# EAGLE design canboard (EAGLE 5.09)
REV: 0.1a

## Sheet 1 of 3
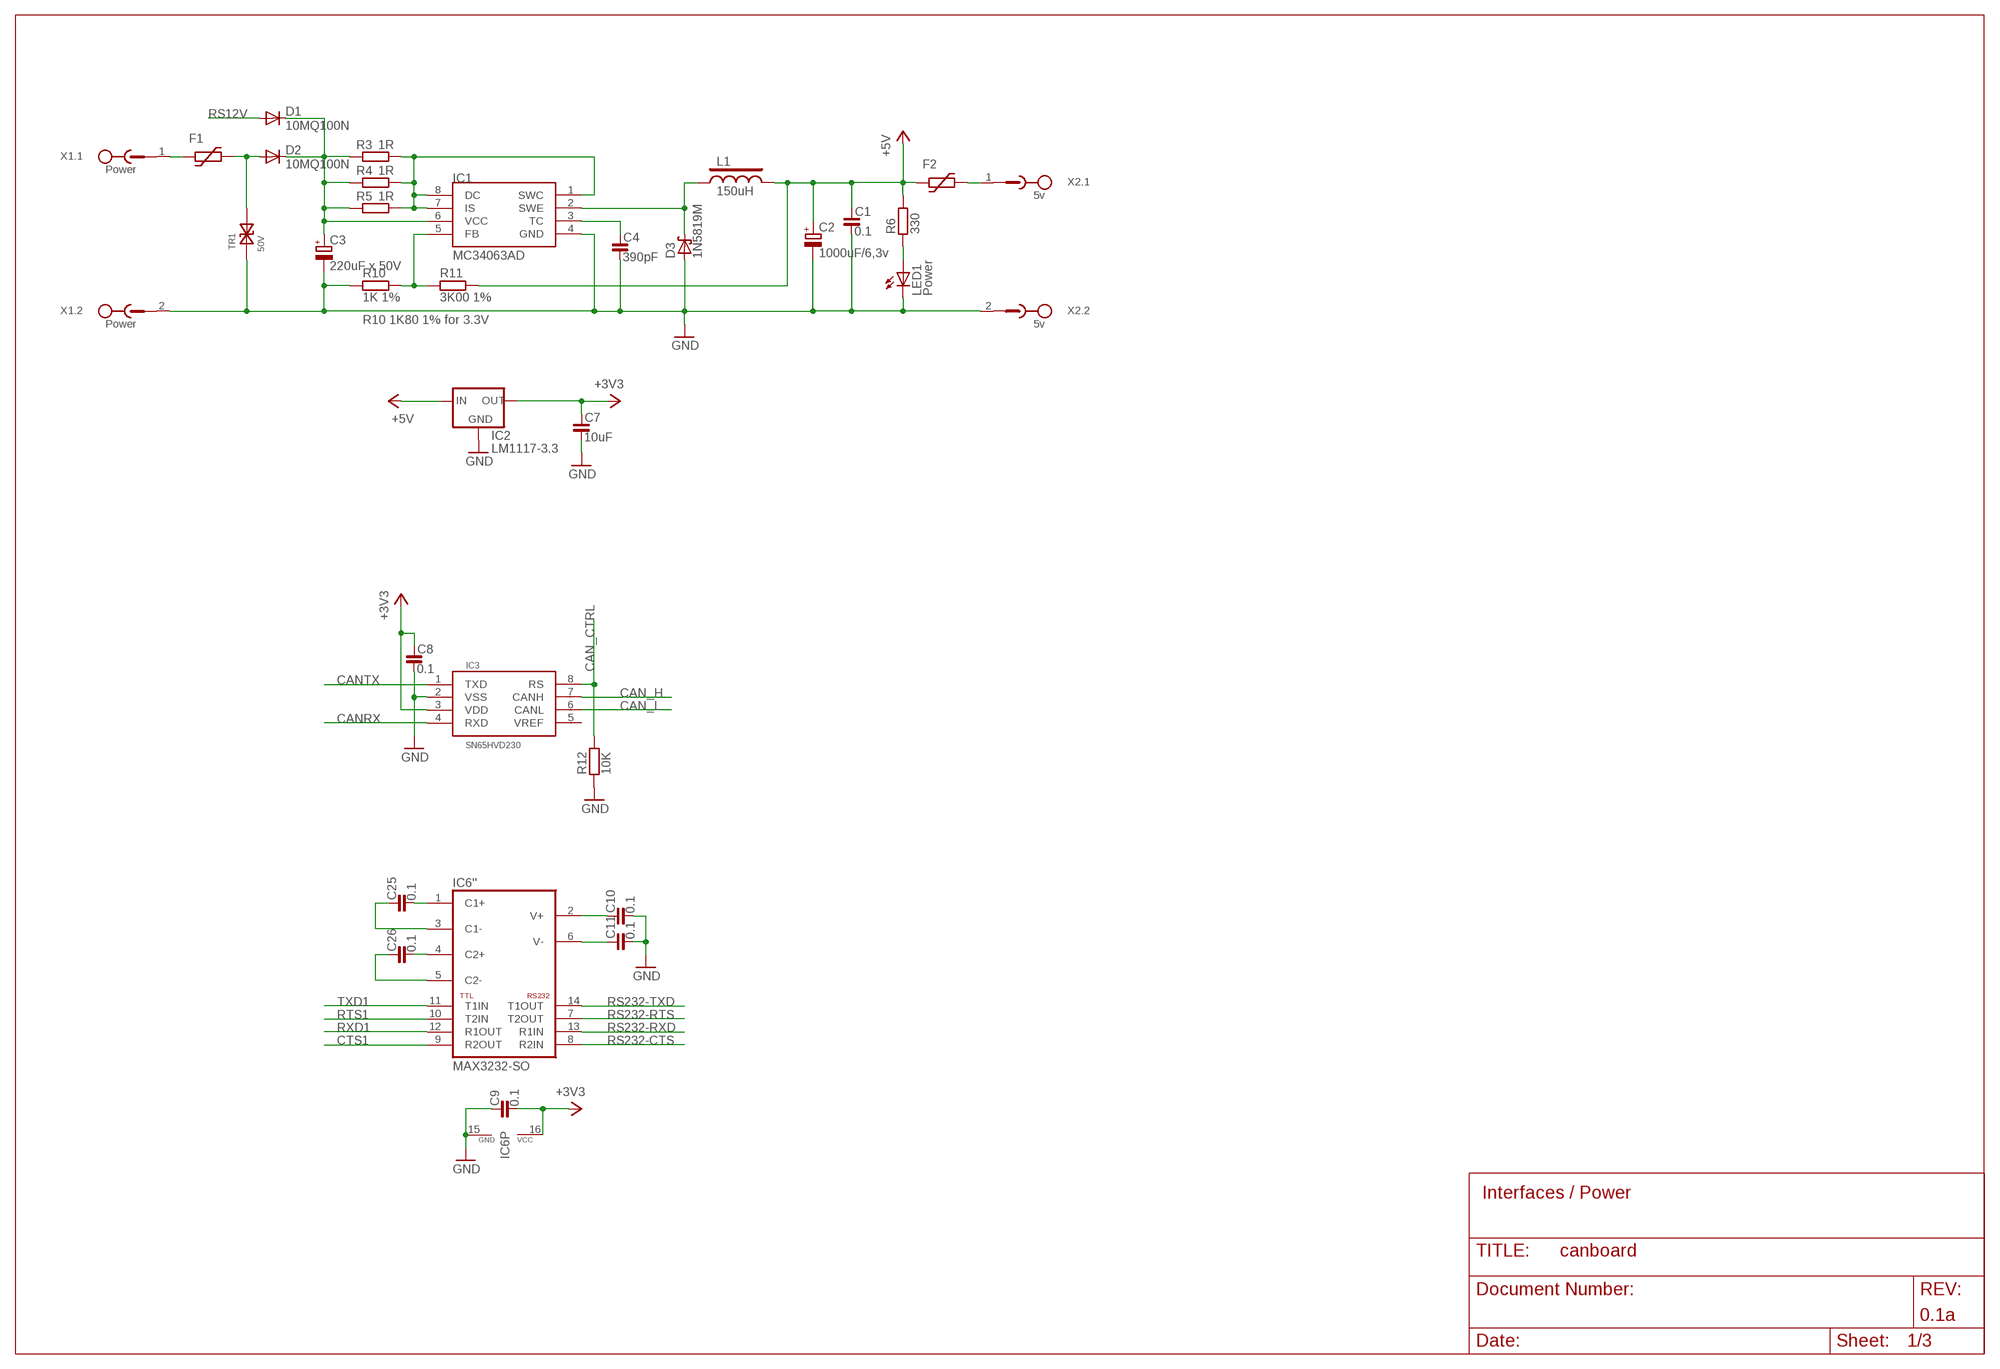
[diagram p0: schematic, sheet 1]

### Parts
C1  0.1  C_0805  [C0805]
C2  1000uF/6,3v  CPOL-E3.5-8  [E3,5-8]
C3  220uF x 50V  CPOL-E3.5-8  [E3,5-8]
C4  390pF  C_0603  [C0603]
C7  10uF  C_0603  [C0603]
C8  0.1  C_0603  [C0603]
C9  0.1  C_0603  [C0603]
C10  0.1  C_0603  [C0603]
C11  0.1  C_0603  [C0603]
C25  0.1  C_0603  [C0603]
C26  0.1  C_0603  [C0603]
D1  10MQ100N  DIODE-SMB  [SMB]
D2  10MQ100N  DIODE-SMB  [SMB]
D3  1N5819M  SCHOTTKY-MELF  [MELF-MLL41]
F1  1812L  [1812L]
F2  1812L  [1812L]
IC1  MC34063AD  [SOIC8]
IC2  LM1117-3.3  LM1117  [SOT223]
IC3  SN65HVD230  [SO8]
IC6  MAX3232-SO  MAX232-SO  [SO16]
L1  150uH  L-RCH895  [RCH895]
LED1  Power  LED3MM  [LED3MM]
R3  1R  R_0805  [R0805]
R4  1R  R_0805  [R0805]
R5  1R  R_0805  [R0805]
R6  330  R_0603  [R0603]
R10  1K 1%  R_0603  [R0603]
R11  3K00 1%  R_0603  [R0603]
R12  10K  R_0603  [R0603]
TR1  50V  TRANSIL-SMB  [SMB]
X1  Power  MC2-G  [MC2-G]
X2  5v  MC2-G  [MC2-G]

### Nets
+3V3: C7.1 C8.1 C9.2 IC2.2(OUT) IC3.3(VDD) IC6.16(P:VCC) ; also sheet 2,3
+5V: C1.1 C2.+ F2.P$1 IC2.3(IN) L1.2 R6.2 R11.2 ; also sheet 3
CAN_CTRL: IC3.8(RS) R12.2
CAN_H: IC3.7(CANH)
CAN_L: IC3.6(CANL)
CANRX: IC3.4(RXD) ; also sheet 2
CANTX: IC3.1(TXD) ; also sheet 2
CTS1: IC6.9('':R2OUT)
GND: C1.2 C2.- C3.- C4.2 C7.2 C8.2 C9.1 C10.2 C11.2 D3.A IC1.4(GND) IC2.1(GND) IC3.2(VSS) IC6.15(P:GND) LED1.K(C) R10.1 R12.1 TR1.A X1.2 X2.2 ; also sheet 2,3
N$1: C4.1 IC1.3(TC)
N$2: D3.C IC1.2(SWE) L1.1
N$3: LED1.A R6.1
N$4: D2.A F1.P$2 TR1.C
N$5: IC1.5(FB) R10.2 R11.1
N$6: IC1.1(SWC) IC1.7(IS) IC1.8(DC) R3.2 R4.2 R5.2
N$7: F1.P$1 X1.1
N$19: F2.P$2 X2.1
N$80: C10.1 IC6.2('':V+)
N$81: C11.1 IC6.6('':V-)
N$82: C26.1 IC6.5('':C2-)
N$83: C26.2 IC6.4('':C2+)
N$84: C25.1 IC6.3('':C1-)
N$85: C25.2 IC6.1('':C1+)
RS12V: D1.A
RS232-CTS: IC6.8('':R2IN)
RS232-RTS: IC6.7('':T2OUT)
RS232-RXD: IC6.13('':R1IN)
RS232-TXD: IC6.14('':T1OUT)
RTS1: IC6.10('':T2IN)
RXD1: IC6.12('':R1OUT) ; also sheet 2
TXD1: IC6.11('':T1IN) ; also sheet 2
VPOW: C3.+ D1.C D2.C IC1.6(VCC) R3.1 R4.1 R5.1
Unconnected: IC3.5(VREF)

### Notes on the sheet
- R10 1K80 1% for 3.3V
- Interfaces / Power

## Sheet 2 of 3
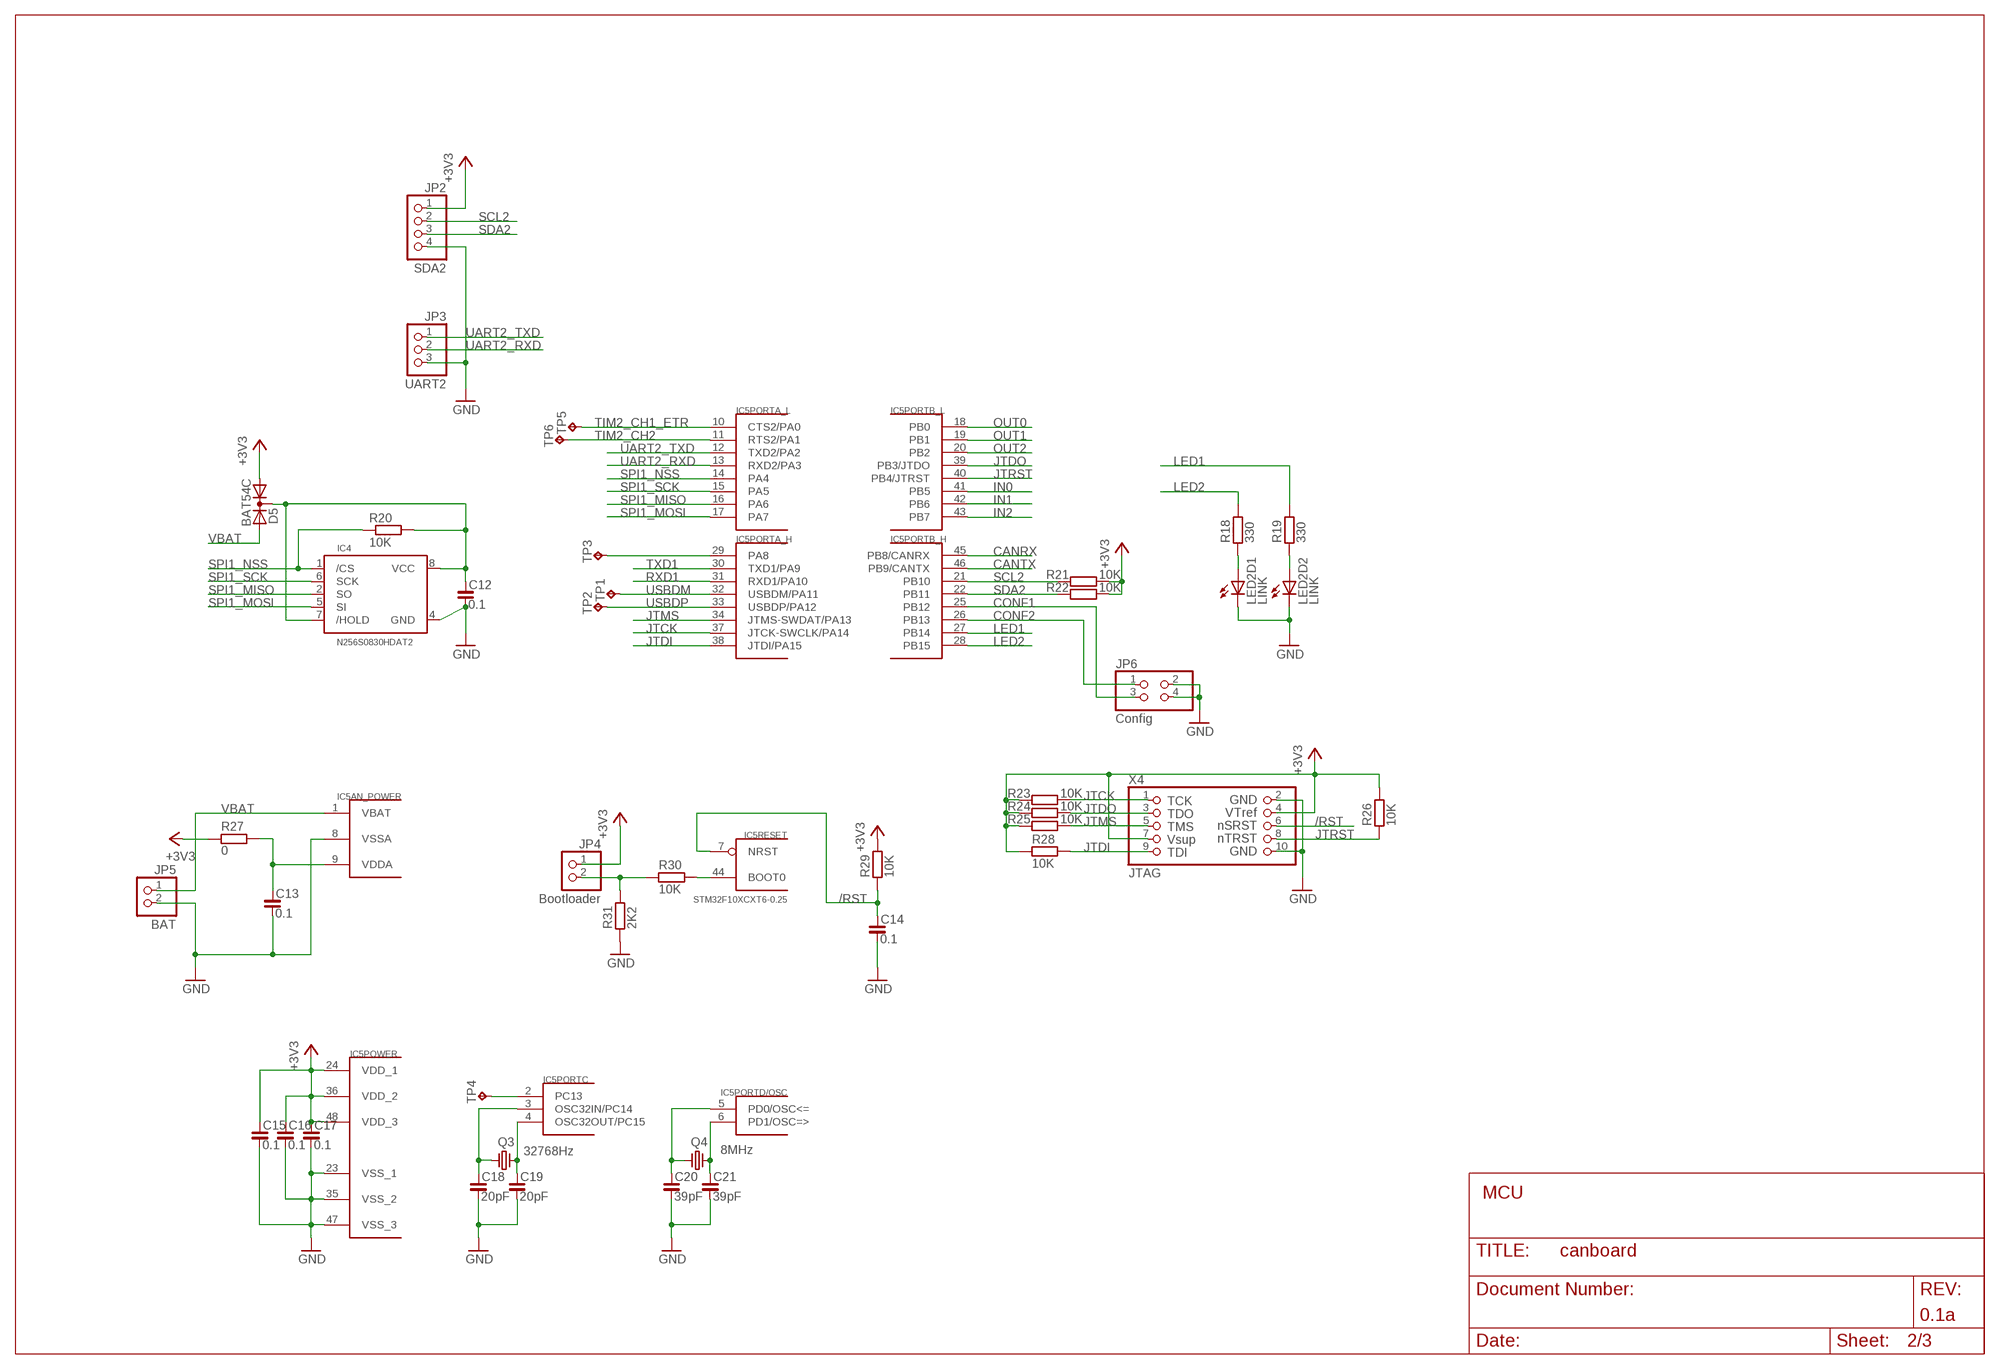
[diagram p1: schematic, sheet 2]

### Parts
C12  0.1  C_0603  [C0603]
C13  0.1  C_0603  [C0603]
C14  0.1  C_0603  [C0603]
C15  0.1  C_0603  [C0603]
C16  0.1  C_0603  [C0603]
C17  0.1  C_0603  [C0603]
C18  20pF  C_0603  [C0603]
C19  20pF  C_0603  [C0603]
C20  39pF  C_0603  [C0603]
C21  39pF  C_0603  [C0603]
D5  BAT54C  DIODE_AC-CA_  [SOT23C]
IC4  N256S0830HDAT2  [TSSOP8]
IC5  STM32F10XCXT6-0.25  [TQFP48-0.24]
JP2  SDA2  PINHD-1X4_2.00  [1X04M]
JP3  UART2  PINHD-1X3_2.00  [1X03M]
JP4  Bootloader  PINHD-1X2_2.54  [1X02]
JP5  BAT  PINHD-1X2_2.54  [1X02]
JP6  Config  PINHD-2X2_2.54  [2X02]
LED2  LINK  ANGLED2  [LED2ANGLE]
Q3  32768Hz  CRYSTAL-TC26H  [TC26H]
Q4  8MHz  CRYSTAL-HC49S  [HC49/S]
R18  330  R_0603  [R0603]
R19  330  R_0603  [R0603]
R20  10K  R-R0603  [R0603]
R21  10K  R_0603  [R0603]
R22  10K  R_0603  [R0603]
R23  10K  R_0603  [R0603]
R24  10K  R_0603  [R0603]
R25  10K  R_0603  [R0603]
R26  10K  R_0603  [R0603]
R27  0  R_0603  [R0603]
R28  10K  R_0603  [R0603]
R29  10K  R_0603  [R0603]
R30  10K  R_0603  [R0603]
R31  2K2  R_0603  [R0603]
TP1  TPB1,27  [B1,27]
TP2  TPB1,27  [B1,27]
TP3  TPB1,27  [B1,27]
TP4  TPB1,27  [B1,27]
TP5  TPB1,27  [B1,27]
TP6  TPB1,27  [B1,27]
X4  JTAG  JTAG10_2.00  [2X05M-JTAG]

### Nets
+3V3: C15.1 C16.1 C17.1 D5.1(A1) IC5.24(POWER:VDD_1) IC5.36(POWER:VDD_2) IC5.48(POWER:VDD_3) JP2.1 JP4.1 R21.2 R22.2 R23.1 R24.1 R25.1 R26.2 R27.1 R28.1 R29.2 X4.4 X4.7 ; also sheet 1,3
/RST: C14.1 IC5.7(RESET:NRST) R29.1 X4.6
CANRX: IC5.45(PORTB_H:PB8/CANRX) ; also sheet 1
CANTX: IC5.46(PORTB_H:PB9/CANTX) ; also sheet 1
CONF1: IC5.25(PORTB_H:PB12) JP6.3
CONF2: IC5.26(PORTB_H:PB13) JP6.1
GND: C12.2 C13.2 C14.2 C15.2 C16.2 C17.2 C18.2 C19.2 C20.2 C21.2 IC4.4(GND) IC5.8(AN_POWER:VSSA) IC5.23(POWER:VSS_1) IC5.35(POWER:VSS_2) IC5.47(POWER:VSS_3) JP2.4 JP3.3 JP5.2 JP6.2 JP6.4 LED2.C1(D1:C) LED2.C2(D2:C) R31.1 X4.2 X4.10 ; also sheet 1,3
IN0: IC5.41(PORTB_L:PB5) ; also sheet 3
IN1: IC5.42(PORTB_L:PB6) ; also sheet 3
IN2: IC5.43(PORTB_L:PB7) ; also sheet 3
JTCK: IC5.37(PORTA_H:JTCK-SWCLK/PA14) R23.2 X4.1
JTDI: IC5.38(PORTA_H:JTDI/PA15) R28.2 X4.9
JTDO: IC5.39(PORTB_L:PB3/JTDO) R24.2 X4.3
JTMS: IC5.34(PORTA_H:JTMS-SWDAT/PA13) R25.2 X4.5
JTRST: IC5.40(PORTB_L:PB4/JTRST) R26.1 X4.8
LED1: IC5.27(PORTB_H:PB14) R19.2
LED2: IC5.28(PORTB_H:PB15) R18.2
N$11: IC5.44(RESET:BOOT0) R30.2
N$12: JP4.2 R30.1 R31.2
N$15: C13.1 IC5.9(AN_POWER:VDDA) R27.2
N$16: IC5.2(PORTC:PC13) TP4.PP(TP)
N$18: C19.1 IC5.4(PORTC:OSC32OUT/PC15) Q3.2
N$20: C18.1 IC5.3(PORTC:OSC32IN/PC14) Q3.1
N$32: LED2.A1(D1:A) R18.1
N$33: LED2.A2(D2:A) R19.1
N$34: IC5.29(PORTA_H:PA8) TP3.PP(TP)
N$35: C12.1 D5.3(K) IC4.7(/HOLD) IC4.8(VCC) R20.2
OUT0: IC5.18(PORTB_L:PB0) ; also sheet 3
OUT1: IC5.19(PORTB_L:PB1) ; also sheet 3
OUT2: IC5.20(PORTB_L:PB2) ; also sheet 3
RXD1: IC5.31(PORTA_H:RXD1/PA10) ; also sheet 1
SCL2: IC5.21(PORTB_H:PB10) JP2.2 R21.1
SDA2: IC5.22(PORTB_H:PB11) JP2.3 R22.1
SPI1_MISO: IC4.2(SO) IC5.16(PORTA_L:PA6)
SPI1_MOSI: IC4.5(SI) IC5.17(PORTA_L:PA7)
SPI1_NSS: IC4.1(/CS) IC5.14(PORTA_L:PA4) R20.1
SPI1_SCK: IC4.6(SCK) IC5.15(PORTA_L:PA5)
TIM2_CH1_ETR: IC5.10(PORTA_L:CTS2/PA0) TP5.PP(TP)
TIM2_CH2: IC5.11(PORTA_L:RTS2/PA1) TP6.PP(TP)
TXD1: IC5.30(PORTA_H:TXD1/PA9) ; also sheet 1
UART2_RXD: IC5.13(PORTA_L:RXD2/PA3) JP3.2
UART2_TXD: IC5.12(PORTA_L:TXD2/PA2) JP3.1
USBDM: IC5.32(PORTA_H:USBDM/PA11) TP1.PP(TP)
USBDP: IC5.33(PORTA_H:USBDP/PA12) TP2.PP(TP)
VBAT: D5.2(A2) IC5.1(AN_POWER:VBAT) JP5.1
XTAL1: C20.1 IC5.5(PORTD/OSC:PD0/OSC<=) Q4.1
XTAL2: C21.1 IC5.6(PORTD/OSC:PD1/OSC=>) Q4.2

### Notes on the sheet
- MCU

## Sheet 3 of 3
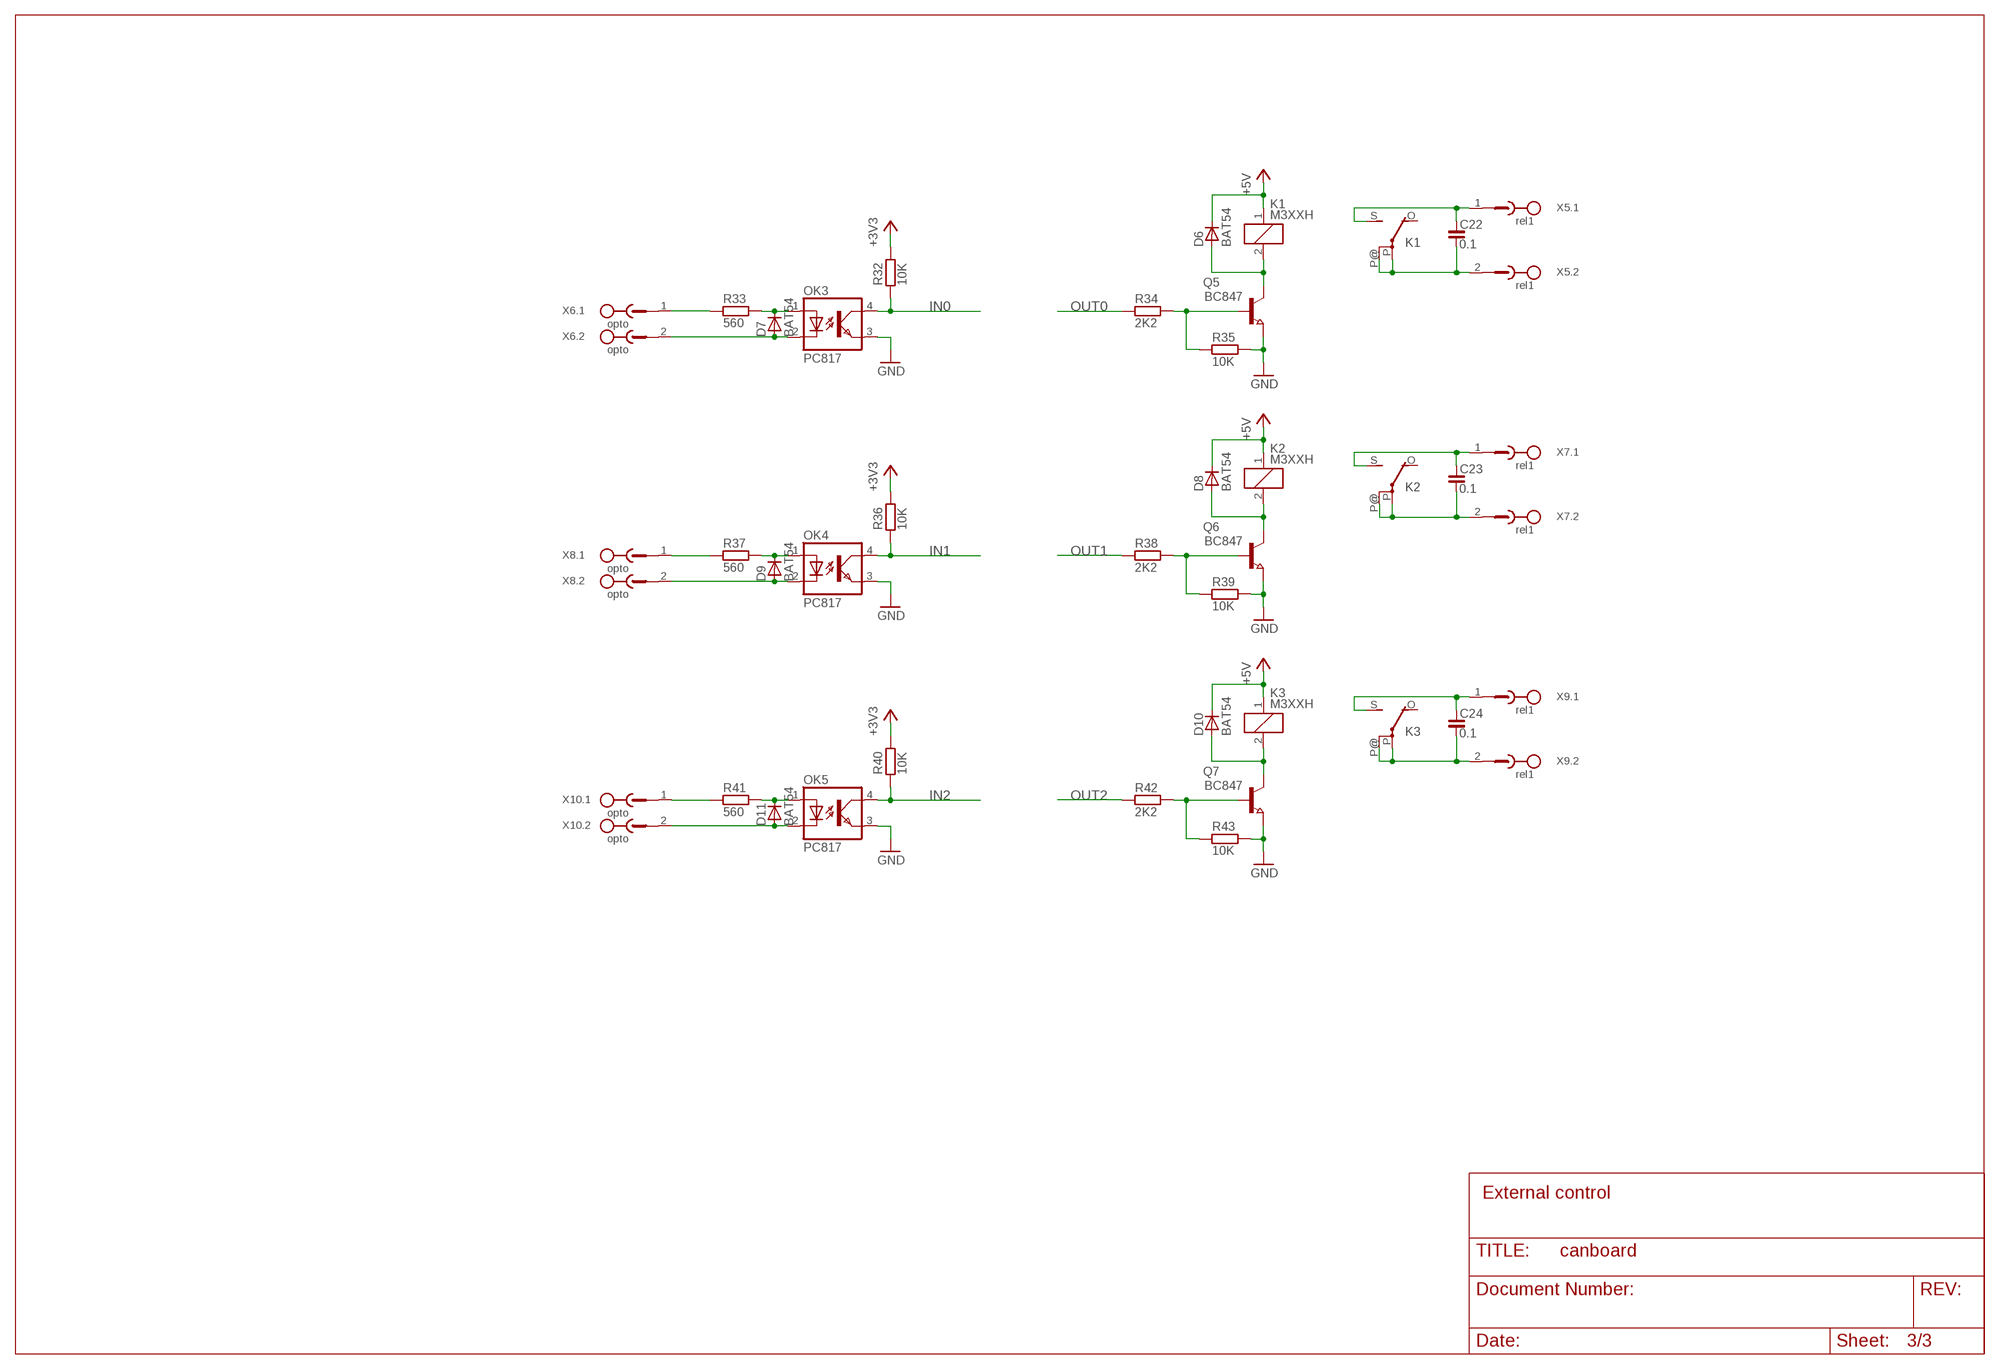
[diagram p2: schematic, sheet 3]

### Parts
C22  0.1  C_1206  [C1206]
C23  0.1  C_1206  [C1206]
C24  0.1  C_1206  [C1206]
D6  BAT54  D-A1-C3  [SOT23]
D7  BAT54  D-A1-C3  [SOT23]
D8  BAT54  D-A1-C3  [SOT23]
D9  BAT54  D-A1-C3  [SOT23]
D10  BAT54  D-A1-C3  [SOT23]
D11  BAT54  D-A1-C3  [SOT23]
K1  M3XXH  [M3XXH]
K2  M3XXH  [M3XXH]
K3  M3XXH  [M3XXH]
OK3  PC817  [DIL04]
OK4  PC817  [DIL04]
OK5  PC817  [DIL04]
Q5  BC847  NPN-TRANSISTOR_SOT23  [SOT23]
Q6  BC847  NPN-TRANSISTOR_SOT23  [SOT23]
Q7  BC847  NPN-TRANSISTOR_SOT23  [SOT23]
R32  10K  R_0603  [R0603]
R33  560  R_0603  [R0603]
R34  2K2  R_0603  [R0603]
R35  10K  R_0603  [R0603]
R36  10K  R_0603  [R0603]
R37  560  R_0603  [R0603]
R38  2K2  R_0603  [R0603]
R39  10K  R_0603  [R0603]
R40  10K  R_0603  [R0603]
R41  560  R_0603  [R0603]
R42  2K2  R_0603  [R0603]
R43  10K  R_0603  [R0603]
X5  rel1  MC2-G  [MC2-G]
X6  opto  MC2-G  [MC2-G]
X7  rel1  MC2-G  [MC2-G]
X8  opto  MC2-G  [MC2-G]
X9  rel1  MC2-G  [MC2-G]
X10  opto  MC2-G  [MC2-G]

### Nets
+3V3: R32.2 R36.2 R40.2 ; also sheet 1,2
+5V: D6.3(C) D8.3(C) D10.3(C) K1.1 K2.1 K3.1 ; also sheet 1
GND: OK3.3(EMIT) OK4.3(EMIT) OK5.3(EMIT) Q5.2(E) Q6.2(E) Q7.2(E) R35.2 R39.2 R43.2 ; also sheet 1,2
IN0: OK3.4(COL) R32.1 ; also sheet 2
IN1: OK4.4(COL) R36.1 ; also sheet 2
IN2: OK5.4(COL) R40.1 ; also sheet 2
N$21: C22.2 K1.P(2:P) K1.P@(2:P) X5.2
N$24: C22.1 K1.S(2:S) X5.1
N$25: C23.1 K2.S(2:S) X7.1
N$27: C23.2 K2.P(2:P) K2.P@(2:P) X7.2
N$28: C24.1 K3.S(2:S) X9.1
N$29: C24.2 K3.P(2:P) K3.P@(2:P) X9.2
N$37: D8.1(A) K2.2 Q6.3(C)
N$38: D6.1(A) K1.2 Q5.3(C)
N$39: Q5.1(B) R34.2 R35.1
N$40: Q6.1(B) R38.2 R39.1
N$41: D10.1(A) K3.2 Q7.3(C)
N$42: Q7.1(B) R42.2 R43.1
N$47: R33.1 X6.1
N$48: D7.3(C) OK3.1(A) R33.2
N$49: D7.1(A) OK3.2(C) X6.2
N$52: R37.1 X8.1
N$53: D9.3(C) OK4.1(A) R37.2
N$54: D9.1(A) OK4.2(C) X8.2
N$56: R41.1 X10.1
N$57: D11.3(C) OK5.1(A) R41.2
N$58: D11.1(A) OK5.2(C) X10.2
OUT0: R34.1 ; also sheet 2
OUT1: R38.1 ; also sheet 2
OUT2: R42.1 ; also sheet 2
Unconnected: K1.O(2:O) K2.O(2:O) K3.O(2:O)

### Notes on the sheet
- External control

## Library data of the parts
C1 C4 C7-C26 = rc-master-smd:C_: NON-POLARIZED CAP
C2 C3 = rs485:CPOL-: POLARIZED CAPACITOR, European symbol
D1 D2 = rs485:DIODE-: DIODE
D3 = rs485:SCHOTTKY-: Schottky Diode
D5 = semicon-smd-ipc:DIODE_AC-CA_: DUAL DIODE
D6-D11 = semicon-smd-ipc:D-: DIODE unfilled
F1 F2 = discrete:1812L
IC1 = rs485:MC34063: 1.5 A, Step-Up/Down/Inverting Switching Regulator
IC2 = v-reg-3:LM1117
IC3 = can-phy:SN65HVD230: CAN PHY driver
IC4 = sram:N256S08: 256Kb Low Power Serial SRAMs 32K × 8 bit Organization; SPEED: 20Mhz; SUPPLY: 3V
IC5 = stm32:STM32F10XCXT6: ST STM32F101/103 48pin LQFP
IC6 = rs232-rs485:MAX232: RS232 TRANSEIVER
JP2 = pinhead-1:PINHD-1X4: PIN HEADER
JP3 = pinhead-1:PINHD-1X3: PIN HEADER
JP4 JP5 = pinhead-1:PINHD-1X2: PIN HEADER
JP6 = pinhead-1:PINHD-2X2: PIN HEADER
K1-K3 = relay:M3XXH: RELAY 1 x switch
L1 = discrete:L-: Inductors
LED1 = rs485:LED: LED OSRAM: - CHIPLED LG R971, LG N971, LY N971, LG Q971, LY Q971, LO R971, LY R971 LH N974, LH R974 LS Q976, LO Q976, LY Q976 LO Q996 - Hyper CHIPLED LW Q18S LB Q993, LB Q99A, LB R99A - SideLED LS A670, LO A670, LY A670, LG A670, LP A670 LB A673, LV A673, LT A673, LW A673 LH A674 LY A675 LS A676, LA A676, LO A676, LY A676, LW A676 LS A679, LY A679, LG A679 - Hyper Micro SIDELED® LS Y876, LA Y876, LO Y876, LY Y876 LT Y87S - SmartLED LW L88C, LW L88S LB L89C, LB L89S, LG L890 LS L89K, LO L89K, LY L89K LS L896, LA L896, LO L896, LY L896 - TOPLED LS T670, LO T670, LY T670, LG T670, LP T670 LSG T670, LSP T670, LSY T670, LOP T670, LYG T670 LG T671, LOG T671, LSG T671 LB T673, LV T673, LT T673, LW T673 LH T674 LS T676, LA T676, LO T676, LY T676, LB T676, LH T676, LSB T676, LW T676 LB T67C, LV T67C, LT T67C, LS T67K, LO T67K, LY T67K, LW E67C LS E67B, LA E67B, LO E67B, LY E67B, LB E67C, LV E67C, LT E67C LW T67C LS T679, LY T679, LG T679 LS T770, LO T770, LY T770, LG T770, LP T770 LB T773, LV T773, LT T773, LW T773 LH T774 LS E675, LA E675, LY E675, LS T675 LS T776, LA T776, LO T776, LY T776, LB T776 LHGB T686 LT T68C, LB T68C - Hyper Mini TOPLED® LB M676 - Mini TOPLED Santana® LG M470 LS M47K, LO M47K, LY M47K Source: http://www.osram.convergy.de - LUMILED® LXK2-PW12-R00, LXK2-PW12-S00, LXK2-PW14-U00, LXK2-PW14-V00 LXK2-PM12-R00, LXK2-PM12-S00, LXK2-PM14-U00 LXK2-PE12-Q00, LXK2-PE12-R00, LXK2-PE12-S00, LXK2-PE14-T00, LXK2-PE14-U00 LXK2-PB12-K00, LXK2-PB12-L00, LXK2-PB12-M00, LXK2-PB14-N00, LXK2-PB14-P00, LXK2-PB14-Q00 LXK2-PR12-L00, LXK2-PR12-M00, LXK2-PR14-Q00, LXK2-PR14-R00 LXK2-PD12-Q00, LXK2-PD12-R00, LXK2-PD12-S00 LXK2-PH12-R00, LXK2-PH12-S00 LXK2-PL12-P00, LXK2-PL12-Q00, LXK2-PL12-R00 Source: www.luxeon.com
LED2 = led1:ANGLED2: 2 LEDs angled holder
OK3-OK5 = opto1:PC817: SHARP OPTO COUPLER
Q3 Q4 = discrete:CRYSTAL-: CRYSTAL
Q5-Q7 = semicon-smd-ipc:NPN-TRANSISTOR_: NPN TRANSISTOR
R3-R6 R10-R12 R18 R19 R21-R43 = rc-master-smd:R_: RESISTOR
R20 = rs485:R-: RESISTOR, European symbol
TP1-TP6 = testpad:TP: Test pad
TR1 = rs485:TRANSIL-: Transil BIDIR.
X1 X2 X5-X10 = con-phoenix-381_l:MC2-G: Mini-Combicon 3.81mm horizontal 2-polig (mit Gegenstecker)
X4 = jtag:JTAG10: 10 pin JTAG connector http://www.ethernut.de/en/hardware/enut3/jtag.html

## Board
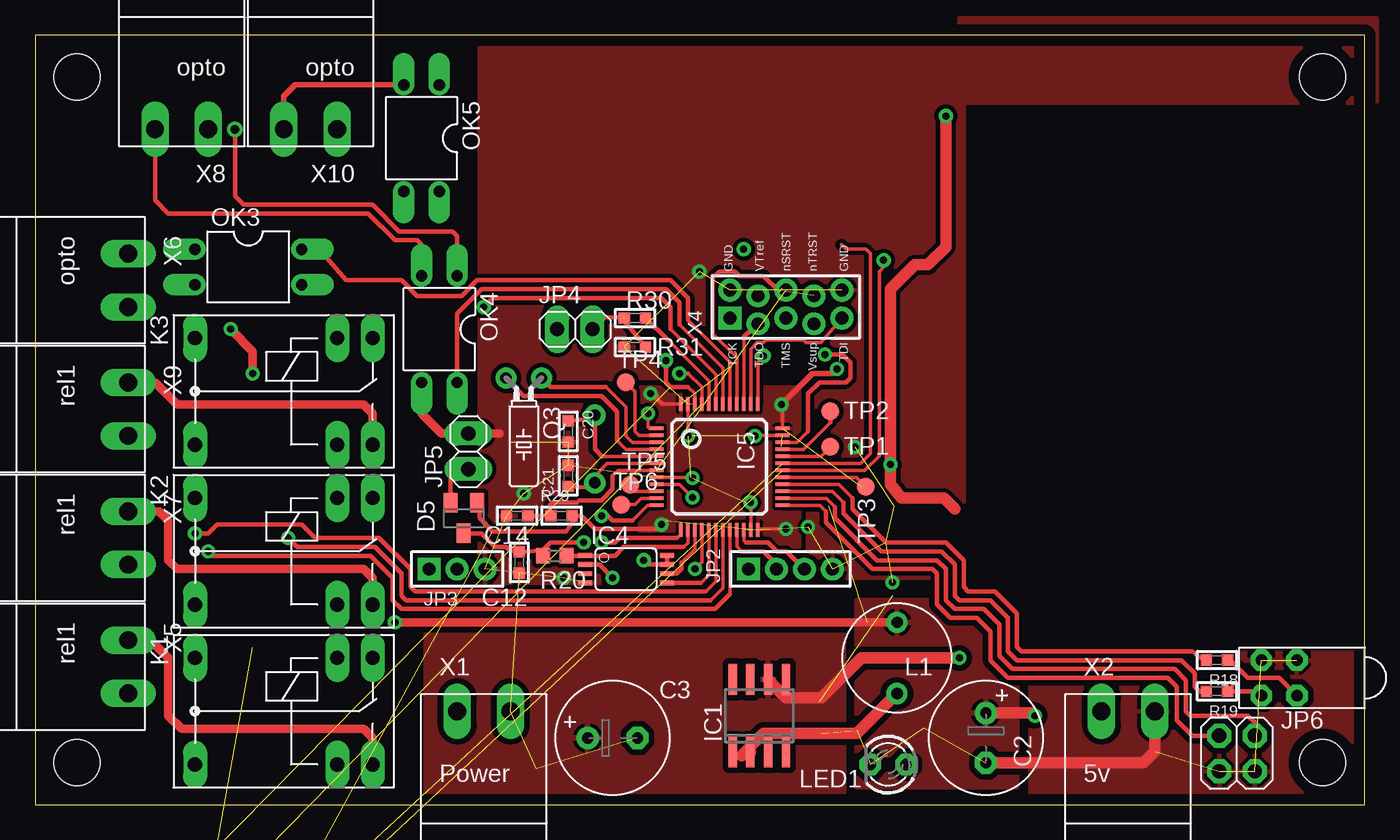
[diagram p3: board, top side]
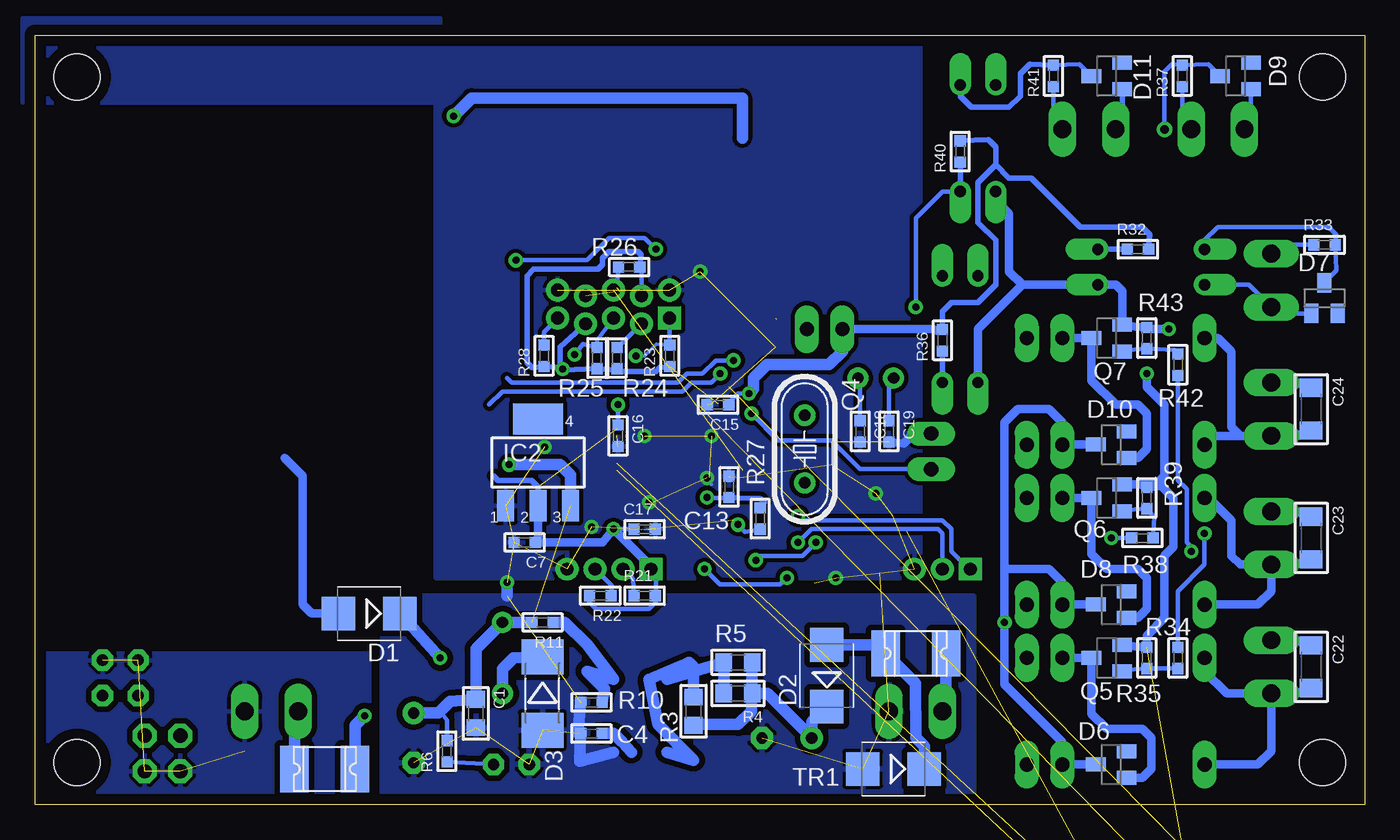
[diagram p4: board, bottom side, seen from below]

Size 95 x 55 mm. Coordinates in mm from the lower left corner, seen from the top.
Outline: 0,0 95,0 95,55 0,55 0,0
Copper layers (1*16): Top 0.035mm / dielectric 1.5mm / Bottom 0.035mm
Design rules "default *": minimum track width 0.24mm, minimum drill 0.5mm, track to track 0.24mm, track to pad 0.24mm, pad to pad 0.24mm, via to via 0.24mm, smd to smd 0.24mm, copper to edge 30mil, drill to drill 8mil, minimum pad ring 14mil, minimum via ring 10mil, stop-mask expansion 4mil, vias tented up to drill 0.6mm, thermal gap 10mil
Holes 3.3 mm at 3,52 3,3 92,3 92,52

### Footprints (pad centres in the part's own frame; a part is rotated, then mirrored left to right if it is on the bottom)
C0805 = smd 1.2 x 1.3: 1 -1.016,0; 2 1.016,0
E3,5-8 = drill 0.813 pad 1.6 round: + -1.778,0 | drill 0.813 pad 1.6 octagon: - 1.778,0
C0603 = smd 0.8 x 0.8: 1 -0.762,0; 2 0.762,0
C1206 = smd 1.3 x 1.6: 1 -1.524,0; 2 1.524,0
SMB = smd 2.4 x 2.4: A 2.2,0; C -2.2,0
MELF-MLL41 = smd 2.5 x 3: A 2.625,0; C -2.625,0
SOT23C = smd 1 x 1.4: 1 -0.95,-1.1; 2 0.95,-1.1; 3 0,1.1
SOT23 = smd 1 x 1.4: 1 -0.95,-1.1; 2 0.95,-1.1; 3 0,1.1
1812L = smd 2.03 x 3.3: P$1 -2.16,0; P$2 2.16,0
SOIC8 = smd 0.6 x 2.2: 1 -1.905,-2.6; 2 -0.635,-2.6; 3 0.635,-2.6; 4 1.905,-2.6; 5 1.905,2.6; 6 0.635,2.6; 7 -0.635,2.6; 8 -1.905,2.6
SOT223 = smd 1.219 x 2.235: 1 -2.311,-3.099; 2 0,-3.099; 3 2.311,-3.099 | smd 3.6 x 2.2: 4 0,3.099
SO8 = smd 0.61 x 1.524: 1 -1.27,-2.743; 2 0,-2.743; 3 1.27,-2.743; 4 2.54,-2.743; 5 2.54,2.743; 6 1.27,2.743; 7 0,2.743; 8 -1.27,2.743
TSSOP8 = smd 0.35 x 1: 1 -0.975,-2.925; 2 -0.325,-2.925; 3 0.325,-2.925; 4 0.975,-2.925; 5 0.975,2.925; 6 0.325,2.925; 7 -0.325,2.925; 8 -0.975,2.925
TQFP48-0.24 = smd 0.25 x 1: 1 -2.75,-4.5; 2 -2.25,-4.5; 3 -1.75,-4.5; 4 -1.25,-4.5; 5 -0.75,-4.5; 6 -0.25,-4.5; 7 0.25,-4.5; 8 0.75,-4.5; 9 1.25,-4.5; 10 1.75,-4.5; 11 2.25,-4.5; 12 2.75,-4.5; 25 2.75,4.5; 26 2.25,4.5; 27 1.75,4.5; 28 1.25,4.5; 29 0.75,4.5; 30 0.25,4.5; 31 -0.25,4.5; 32 -0.75,4.5; 33 -1.25,4.5; 34 -1.75,4.5; 35 -2.25,4.5; 36 -2.75,4.5 | smd 1 x 0.25: 13 4.5,-2.75; 14 4.5,-2.25; 15 4.5,-1.75; 16 4.5,-1.25; 17 4.5,-0.75; 18 4.5,-0.25; 19 4.5,0.25; 20 4.5,0.75; 21 4.5,1.25; 22 4.5,1.75; 23 4.5,2.25; 24 4.5,2.75; 37 -4.5,2.75; 38 -4.5,2.25; 39 -4.5,1.75; 40 -4.5,1.25; 41 -4.5,0.75; 42 -4.5,0.25; 43 -4.5,-0.25; 44 -4.5,-0.75; 45 -4.5,-1.25; 46 -4.5,-1.75; 47 -4.5,-2.25; 48 -4.5,-2.75
SO16 = smd 0.66 x 2.032: 1 -4.445,-3.073; 2 -3.175,-3.073; 3 -1.905,-3.073; 4 -0.635,-3.073; 5 0.635,-3.073; 6 1.905,-3.073; 7 3.175,-3.073; 8 4.445,-3.073; 9 4.445,3.073; 10 3.175,3.073; 11 1.905,3.073; 12 0.635,3.073; 13 -0.635,3.073; 14 -1.905,3.073; 15 -3.175,3.073; 16 -4.445,3.073
1X04M = drill 0.914 square: 1 -3,0 | drill 0.914 round: 2 -1,0; 3 1,0; 4 3,0
1X03M = drill 0.914 square: 1 -2,0 | drill 0.914 round: 2 0,0; 3 2,0
1X02 = drill 1.016 long: 1 -1.27,0; 2 1.27,0
2X02 = drill 1.016 octagon: 1 -1.27,-1.27; 2 -1.27,1.27; 3 1.27,-1.27; 4 1.27,1.27
M3XXH = drill 1.016 long: 1 -3.81,3.81; 2 -3.81,-3.81; O -6.35,-3.81; P 6.35,-3.81; P@ 6.35,3.81; S -6.35,3.81
RCH895 = drill 0.813 round: 1 0,2.54; 2 0,-2.54
LED3MM = drill 0.813 octagon: A -1.27,0; K 1.27,0
LED2ANGLE = drill 0.813 octagon: A1 2.54,-1.27; A2 0,-1.27; C1 2.54,1.27; C2 0,1.27
DIL04 = drill 0.813 offset: 1 -1.27,-3.81; 2 1.27,-3.81; 3 1.27,3.81; 4 -1.27,3.81
TC26H = drill 0.813 round: 1 -1.27,0; 2 1.27,0
HC49/S = drill 0.813 round: 1 -2.413,0; 2 2.413,0
R0805 = smd 1.2 x 1.3: 1 -1.016,0; 2 1.016,0
R0603 = smd 0.8 x 0.8: 1 -0.762,0; 2 0.762,0
R0603' = smd 1 x 1.1: 1 -0.85,0; 2 0.85,0
B1,27 = smd 1.27 x 1.27: PP 0,0
MC2-G = drill 1.27 long: 1 -1.905,0; 2 1.905,0
2X05M-JTAG = drill 0.914 square: 1 -4,-0.8 | drill 0.914 round: 2 -4,1.2; 3 -2,-1.2; 4 -2,0.8; 5 0,-0.8; 6 0,1.2; 7 2,-1.2; 8 2,0.8; 9 4,-0.8; 10 4,1.2

### Placement (x,y rotation side)
C1  63.5,6.51 270 bottom
C2  67.94,4.76 270 top
C3  41.27,4.76 0 top
C4  55.24,5.08 180 bottom
C7  60.01,18.73 180 bottom
C8  7.78,-27.78 0 top  (outside the outline)
C9  -7.94,-37.62 0 top  (outside the outline)
C10  -3.81,-37.62 0 top  (outside the outline)
C11  0.32,-37.62 0 top  (outside the outline)
C12  34.61,17.3 270 top
C13  45.4,22.7 90 bottom
C14  34.45,20.64 180 top
C15  46.2,28.57 180 bottom
C16  53.34,26.35 270 bottom
C17  51.44,19.68 0 bottom
C18  36.04,26.67 270 bottom
C19  33.97,26.67 270 bottom
C20  38.1,26.67 270 top
C21  38.1,23.5 90 top
C22  3.81,9.84 270 bottom
C23  3.81,19.05 270 bottom
C24  3.81,28.26 270 bottom
C25  4.45,-37.62 0 top  (outside the outline)
C26  8.57,-37.62 0 top  (outside the outline)
D1  71.12,13.65 180 bottom
D2  38.42,9.21 90 bottom
D3  58.74,7.94 270 bottom
D5  30.64,20.48 180 top
D6  18.1,2.86 90 bottom
D7  2.86,36.2 0 bottom
D8  18.1,14.29 90 bottom
D9  9.21,52.07 90 bottom
D10  18.1,25.72 90 bottom
D11  18.41,52.07 90 bottom
F1  32.07,10.79 180 bottom
F2  74.3,2.54 180 bottom
IC1  51.75,6.35 0 top
IC2  59.05,24.45 0 bottom
IC3  -6.19,-21.11 0 top  (outside the outline)
IC4  42.23,16.83 270 top
IC5  48.9,24.13 270 top
IC6  -3.02,-30.16 0 top  (outside the outline)
JP2  53.98,16.83 0 top
JP3  30.16,16.83 0 top
JP4  38.58,33.97 0 top
JP5  30.96,25.24 90 top
JP6  85.88,3.65 180 top
K1  17.78,6.67 180 top
K2  17.78,18.1 180 top
K3  17.78,29.53 180 top
L1  61.59,10.48 180 top
LED1  60.96,2.86 180 top
LED2  87.63,9.05 0 top
OK3  15.24,38.42 270 top
OK4  28.89,33.97 180 top
OK5  27.62,47.62 180 top
Q3  34.92,30.48 180 top
Q4  40.01,25.4 270 bottom
Q5  18.41,10.48 90 bottom
Q6  18.41,21.91 90 bottom
Q7  18.41,33.34 90 bottom
R3  47.94,6.67 90 bottom
R4  44.77,7.94 180 bottom
R5  44.77,10.16 180 bottom
R6  65.56,3.81 90 bottom
R10  55.24,7.3 0 bottom
R11  58.74,13.02 180 bottom
R12  -7.94,-42.7 0 top  (outside the outline)
R18  84.45,10.32 180 top
R19  84.45,8.1 180 top
R20  10K  [R0603']  37.15,17.78 180 top
R21  51.44,14.92 0 bottom
R22  54.61,14.92 180 bottom
R23  49.65,32.07 90 bottom
R24  53.42,31.91 90 bottom
R25  54.85,31.91 90 bottom
R26  52.55,38.42 0 bottom
R27  43.18,20.44 90 bottom
R28  58.62,32.07 90 bottom
R29  37.62,20.64 0 top
R30  42.86,34.77 0 top
R31  42.86,32.7 0 top
R32  16.19,39.69 0 bottom
R33  2.86,40.01 0 bottom
R34  13.34,10.48 270 bottom
R35  15.56,10.48 90 bottom
R36  30.16,33.18 90 bottom
R37  13.02,52.07 90 bottom
R38  15.88,19.05 0 bottom
R39  15.56,21.91 90 bottom
R40  28.89,46.67 90 bottom
R41  22.23,52.07 90 bottom
R42  13.34,31.43 90 bottom
R43  15.56,33.34 90 bottom
TP1  56.83,25.56 0 top
TP2  56.83,28.1 0 top
TP3  59.37,22.7 0 top
TP4  42.23,30.16 0 top
TP5  42.55,22.86 0 top
TP6  41.91,21.43 0 top
TR1  33.66,2.54 180 bottom
X1  32.07,6.67 0 top
X2  78.11,6.67 0 top
X4  53.66,35.56 0 top
X5  6.67,9.84 270 top
X6  6.67,37.47 270 top
X7  6.67,19.05 270 top
X8  10.48,48.26 180 top
X9  6.67,28.26 270 top
X10  19.68,48.26 180 top

### Tracks (layer width: path | path; a pad name or v marks a point on that pad's centre or on a via)
+3V3  (via drill 0.5)  (7 unrouted)
  Top 0.254: v53.66,19.68 51.7,19.68 IC5.24 | 53.4,28.52 IC5.36 | 44.82,28.63 IC5.48 | 31.75,21.59 D5.1
  Top 0.305: v53.34,28.57 53.4,28.52 | 44.82,28.63 v43.97,29.37 44.45,29.21 | v44.77,20 45.09,20.32 | v44.77,20 44.45,19.68 40.01,19.68 39.05,20.64 R29.2 38.47,20.22 37.94,19.53 32.7,19.53 31.75,20.48 31.75,21.59 | v44.77,20
  Top 0.406: v57.31,31.11 | v57.31,31.11 56.99,30.8 55.56,30.8 v53.34,28.57
  Bottom 0.305: v53.66,19.68 C17.1 | v53.34,28.57 C16.1 | R27.1 44.25,19.49 v44.77,20 | JP2.1 50.59,16.44 R21.2 50.59,14.5 51.12,13.97 54.93,13.97 55.46,14.5 R22.2 | X4.4 51.66,38.22 R26.2 | C15.1 45.35,28.79 44.77,29.37 v43.97,29.37
  Bottom 0.406: R40.2 26.89,47.52 26.35,46.99 26.35,45.72 | 26.35,45.72 25.4,44.77 23.81,44.77 20.32,41.27 15.88,41.27 15.34,40.74 R32.2 | R36.2 30.16,35.24 29.53,35.88 27.62,35.88 26.35,37.15 26.35,40.32 27.62,41.59 27.62,44.45 26.35,45.72 | R26.2 51.7,39.31 51.91,39.53 53.98,39.53 54.45,39.05 54.45,38.58 54.77,38.26 59.37,38.26 59.85,37.78 59.85,31.59 59.48,31.22 R28.1 57.47,31.22 | X4.7 57.47,32.7 57.47,31.22 | R23.1 50.38,31.22 50.64,30.96 53.18,30.96 53.44,31.06 R24.1 53.5,31.22 | 62.23,23.5 61.91,23.18 59.53,23.18 59.05,22.7 IC2.2 | 53.58,31.06 R25.1 57.25,31.06 v57.31,31.11 57.41,31.22 57.47,31.22
  Bottom 0.61: R36.2 30.58,33.87 30.8,33.97 JP4.1 | IC2.2 59.05,19.15 C7.1 54.45,18.73 v53.66,19.68 50.98,17 JP2.1 | R24.1 53.58,31.06
  Bottom 0.813: v43.97,29.37 | v43.97,29.37 43.66,29.69 43.66,30.48 42.7,31.43 38.26,31.43 37.31,32.38 JP4.1
  pour Top: 43.18,18.41 54.61,18.41 54.61,29.84 43.18,29.84
+5V  (via drill 0.5)  (1 unrouted)
  Top 0.61: v25.72,13.02 L1.2
  Top 0.813: C2.+ 71.25,6.54 v71.44,6.35 | 65.72,21.11 64.93,21.91 61.91,21.91 61.12,22.86 v61.12,24.29 61.12,36.83 62.87,38.58 63.82,38.58 65.09,39.85 v65.09,49.21
  Bottom 0.305: R6.2 65.56,6.03 66.04,6.67
  Bottom 0.61: D10.3 K3.1 21.59,27.3 22.54,28.26 24.77,28.26 25.72,27.3 25.72,16.83 | D8.3 K2.1 21.59,15.88 22.54,16.83 25.72,16.83 | D6.3 K1.1 21.59,4.45 25.72,8.57 v25.72,13.02 25.72,16.83
  Bottom 0.813: R11.2 L1.2 63.5,11.11 C1.1 65.35,7.36 66.04,6.67 66.17,6.54 C2.+ | 44.45,47.64 44.45,50.48 63.82,50.48 v65.09,49.21 | F2.P$1 72.14,5.65 v71.44,6.35 | IC2.3 56.74,23.57 57.47,24.29 v61.12,24.29
  pour Top (isolate 0.406): 58.74,14.61 70.17,14.61 70.17,1.27 58.74,1.27
/RST  (1 unrouted)
  Top 0.254: IC5.7 41.66,23.88 41.27,23.5
  Top 0.305: 41.27,23.5 41.27,22.54 40.48,21.75 38.89,21.75 38.73,21.59 36.99,21.59 36.77,21.38 R29.1 C14.1
CAN_CTRL  (1 unrouted)
CANRX  (via drill 0.5)  (1 unrouted)
  Top 0.254: IC5.45 47.65,29.82 46.67,30.8
  Top 0.305: 46.67,30.8 v46.04,30.8
  Bottom 0.305: v46.04,30.8 46.67,30.16 48.1,30.16 48.74,29.53 61.59,29.53 62.55,28.57
CANTX  (via drill 0.5)  (1 unrouted)
  Top 0.254: IC5.46 47.15,29.37 46.67,29.84
  Top 0.305: 46.67,29.84 45.4,29.84 45.09,30.16 v45.09,31.75
  Bottom 0.305: v45.09,31.75 46.35,31.75 47.31,30.8 48.42,30.8 49.05,30.16 60.96,30.16 61.28,30.48
CONF1
  Top 0.254: IC5.25 56.09,21.38 56.52,20.95
  Top 0.305: 56.52,20.95 56.52,20.16 59.85,16.83 64.14,16.83 64.45,16.51 64.45,14.29 65.41,13.34 67.31,13.34 68.26,12.38 68.26,10.32 69.53,9.05 80.96,9.05 81.6,8.41 81.6,6.03 82.71,4.92 JP6.3
CONF2
  Top 0.254: IC5.26 56.54,21.88 57.15,21.27
  Top 0.305: 57.15,21.27 57.15,20.48 60.17,17.46 64.45,17.46 65.09,16.83 65.09,14.61 65.72,13.97 67.79,13.97 68.9,12.86 68.9,10.64 69.85,9.68 81.44,9.68 82.23,8.89 82.23,6.67 82.55,6.35 86.68,6.35 87.15,5.87 JP6.1
GND  (via drill 0.5)  (47 unrouted)
  Top 0.254: IC5.23 51.15,21.56 | 51.46,26.38 IC5.35 | 46.65,26.38 IC5.47 | IC5.8 46.83,23.38 v46.99,23.34
  Top 0.305: 51.15,21.56 v51.12,21.59 | v51.44,26.35 51.46,26.38 | v46.67,26.35 46.65,26.38
  Top 0.61: v15.56,30.8 15.56,32.38 v13.97,33.97 | OK4.3 27.62,27.94 29.05,26.51 JP5.2 33.18,26.51
  Top 0.813: C2.- 79.18,2.98 80.01,3.81 X2.2
  Bottom 0.254: v46.99,23.34 46.67,22.86
  Bottom 0.305: v51.12,21.59 50.8,21.59 | v51.44,26.35 51.44,26.04 | v46.67,26.35 46.99,26.35 | 16.9,34.19 Q7.2 | R39.2 16.9,22.76 Q6.2 | 16.9,11.33 Q5.2 | 15.56,22.86 | 15.34,33.97 R43.2
  Bottom 0.61: R43.2 16.9,34.19 | 16.9,11.33 R35.2 15.56,12.06 14.29,13.34 14.29,17.78 13.65,18.41 13.65,21.91 14.5,22.76 R39.2 | Q6.2 15.56,22.86 | v13.97,33.97 15.34,33.97 | Q7.2 17.32,36.68 17.78,37.15 OK3.3 24.45,37.15 | OK5.3 26.35,43.18 25.4,42.23 25.4,38.1 24.45,37.15 | OK4.3 27.62,33.97 24.45,37.15 | 15.56,22.86 14.92,22.86 14.29,23.5 14.29,28.57 15.56,29.84 v15.56,30.8 | JP5.2 32.23,26.51 32.92,25.82 C19.2
  Bottom 0.813: R10.1 56.2,5.08 C4.2 56.09,3.07 IC1.4 | 61.28,14.92 v61.28,15.88
  other vias: 34.92,22.23 47.47,38.1 58.58,25.56 55.24,19.84 37.78,16.19
  pour Bottom (isolate 0.406): 70.17,-1.59 70.17,14.92 27.94,14.92 27.94,-1.59
  pour Bottom (isolate 0.305): 66.36,16.19 31.75,16.19 31.75,55.56 66.36,55.56
  pour Top (isolate 0.305): 42.55,15.56 31.75,15.56 31.75,55.88 66.36,55.88 66.36,16.19 55.24,16.19 55.24,30.48 42.55,30.48
  pour Bottom (isolate 0.406): 71.12,-0.64 95.57,-0.64 95.57,10.79 71.12,10.79
  pour Top (isolate 0.406): 71.12,-0.64 95.57,-0.64 95.57,10.79 71.12,10.79
  pour Top (isolate 0.406): 66.04,50.16 95.89,50.16 95.89,56.2 66.04,56.2
  pour Bottom (isolate 0.406): 66.04,50.16 95.89,50.16 95.89,56.2 66.04,56.2
IN0
  Top 0.254: IC5.41 49.65,31.64 46.67,34.61
  Top 0.305: 46.67,34.61 46.67,36.2 45.4,37.47 31.59,37.47 30.48,36.35 27.3,36.35 26.19,37.47 22.23,37.47 20.32,39.69 OK3.4
  Bottom 0.406: R32.1 OK3.4
IN1
  Top 0.254: 46.04,34.29 49.15,31.18 IC5.42
  Top 0.305: 46.04,34.29 46.04,35.88 45.09,36.83 31.91,36.83 30.16,35.08 OK4.4
  Bottom 0.406: OK4.4 R36.1
IN2  (via drill 0.5)
  Top 0.254: IC5.43 48.65,30.73 45.4,33.97
  Top 0.305: v32.07,35.56 32.7,36.2 44.77,36.2 45.4,35.56 45.4,33.97
  Bottom 0.305: v32.07,35.56 32.07,41.91 30.16,43.81 OK5.4
  Bottom 0.406: OK5.4 R40.1
JTCK  (via drill 0.5)
  Top 0.254: IC5.37 51.65,31.64 v52.07,32.07
  Bottom 0.254: v52.07,32.07 51.44,32.07 50.59,32.92 R23.2
  Bottom 0.305: R23.2 49.65,34.65 X4.1
JTDI
  Top 0.254: X4.9 56.18,33.02 55.09,33.02 54.93,33.18 52.23,33.18 52.07,33.02 51.59,33.02 51.15,32.57 IC5.38
  Bottom 0.305: R28.2 58.62,33.77 57.94,34.45 57.67,34.65 X4.9
JTDO
  Top 0.254: IC5.39 50.65,33.45
  Top 0.305: 50.65,33.45 X4.3
  Bottom 0.305: R24.2 53.12,32.92 52.07,33.97 51.67,34.44 X4.3
JTMS  (via drill 0.5)
  Top 0.254: IC5.34 54.45,25.88 55.24,26.67
  Top 0.305: 55.24,26.67 55.24,29.37 56.04,30.16 57.94,30.16 58.26,30.48 58.26,31.59 57.71,32.15 v56.44,32.15
  Bottom 0.305: v56.44,32.15 55.82,32.92 R25.2 54.85,33.15 X4.5
JTRST  (2 unrouted)
  Top 0.254: IC5.40 50.15,31.93 48.42,33.66
  Top 0.305: 48.42,33.66 48.42,37.62 48.9,38.1 50.01,38.1 50.32,37.78 52.07,37.78 53.18,36.67 53.65,36.67
  Bottom 0.305: 53.4,36.92 R26.1
LED1
  Top 0.254: IC5.27 56.99,22.38 57.78,21.59
  Top 0.305: 57.78,21.59 57.78,20.8 60.48,18.1 64.77,18.1 65.72,17.14 65.72,14.92 66.04,14.61 68.26,14.61 69.53,13.34 69.53,10.95 70.17,10.32 81.92,10.32 82.87,9.37 82.87,8.41 83.19,8.1 R19.2
LED2
  Top 0.254: IC5.28 57.45,22.88 58.42,21.91
  Top 0.305: 58.42,21.91 58.42,21.11 60.8,18.73 65.09,18.73 66.36,17.46 66.36,15.56 66.67,15.24 68.58,15.24 70.17,13.65 70.17,11.27 70.48,10.95 82.71,10.95 83.5,10.32 R18.2
N$1
  Bottom 0.813: C4.1 53.66,5.08 53.02,4.45 IC1.3
N$2
  Top 0.813: IC1.2 50.48,3.49 52.07,5.08 58.74,5.08 L1.1
  Bottom 0.813: D3.C 58.97,10.56 60.8,10.48 61.59,9.68 L1.1
N$3
  Bottom 0.305: R6.1 LED1.A
N$4
  Bottom 0.813: TR1.C 31.45,4.15 32.07,4.76 32.09,8.66 F1.P$2 34.84,11.41 D2.A
N$5
  Bottom 0.813: R10.2 54.3,8.26 55.56,9.53 IC1.5 55.56,11.43 57.15,13.02 R11.1
N$6
  Bottom 0.813: R4.2 R5.2 IC1.8 48.26,10.16 | 48.26,10.16 IC1.7 50.48,5.71 47.94,3.17 IC1.1 | R3.2 47.94,9.84 48.26,10.16
N$7
  Bottom 0.813: F1.P$1 29.91,8.19 X1.1
N$11
  Top 0.254: IC5.44 48.15,30.28 45.24,33.18
  Top 0.305: 45.24,33.18 R30.2
N$12  (1 unrouted)
  Top 0.305: R30.1 41.7,34.82 40.68,34.81 JP4.2 | R31.2 42.01,34.71
N$15  (via drill 0.5)
  Top 0.254: IC5.9 46.04,22.88 v46.99,21.95
  Bottom 0.305: R27.2 42.86,21.59 43.18,21.91 46.51,21.91 v46.99,21.95
  Bottom 0.406: C13.1 43.12,21.85 42.86,21.59
N$16
  Top 0.254: IC5.2 43.15,26.38 42.86,26.67 42.86,29.53 TP4.PP
N$18
  Top 0.254: IC5.4 42.25,25.38 41.59,26.04
  Top 0.305: Q3.2 34.92,29.21 40.48,29.21 41.59,28.1 41.59,26.04
  Bottom 0.305: C19.1 33.97,30.16 Q3.2
N$19
  Bottom 0.813: F2.P$2 76.45,6.29 X2.1
N$20
  Top 0.254: 40.8,29.84 42.23,28.42 42.23,26.35 42.7,25.88 IC5.3
  Top 0.305: 40.8,29.84 36.83,29.84 Q3.1
  Bottom 0.305: C18.1 36.04,30.32 Q3.1
N$21
  Bottom 0.61: X5.2 4.87,7.94 C22.2 | K1.P@ 7.62,2.86 6.67,3.81 X5.2 | K1.P 11.43,9.53 9.84,7.94 X5.2
N$24
  Top 0.61: X5.1 8.26,11.75 9.53,10.48 9.53,6.35 10.48,5.4 23.5,5.4 24.13,4.76 K1.S
  Bottom 0.61: X5.1 4.87,11.75 C22.1
N$25
  Top 0.61: X7.1 8.89,20.95 9.53,20.32 9.53,17.46 10.16,16.83 23.5,16.83 24.13,16.19 K2.S
  Bottom 0.61: X7.1 4.87,20.95 C23.1
N$27
  Bottom 0.61: X7.2 4.87,17.14 C23.2 | K2.P@ 7.62,14.29 6.67,15.24 X7.2 | K2.P 11.11,21.91 9.53,20.32 9.53,17.78 8.89,17.14 X7.2
N$28
  Top 0.61: X9.1 8.57,30.16 10.16,28.57 23.5,28.57 24.13,27.94 K3.S
  Bottom 0.61: X9.1 4.87,30.16 C24.1
N$29
  Bottom 0.61: C24.2 4.87,26.35 X9.2 8.57,26.35 | K3.P@ 10.79,26.35 8.57,26.35 | K3.P 10.48,33.34 9.53,32.38 9.53,26.99 8.89,26.35 8.57,26.35
N$32
  Top 0.305: R18.1 85.41,10.32 86.68,9.05 88.9,9.05 LED2.A1
N$33
  Top 0.305: R19.1 87.31,8.1 LED2.A2
N$34
  Top 0.254: IC5.29 58.69,23.38 TP3.PP
N$35  (via drill 0.5)
  Top 0.305: 36.24,18.15 C12.1 33.92,18.15 33.66,18.41 32.86,18.41 32.54,18.73 32.23,19.05 31.9,19.38 D5.3 | 36.24,18.15 R20.2 | v43.5,17.46 43.82,17.15 IC4.7 IC4.8 | 36.24,18.15 36.25,18.15 36.83,18.73 v39.21,18.73
  Bottom 0.305: v43.5,17.46 43.34,17.62 43.18,17.78 40.16,17.78 v39.21,18.73
N$37
  Bottom 0.61: K2.2 Q6.3 19.52,17.93 18.41,16.83 16.19,16.83 15.56,16.19 15.56,13.97 16.19,13.34 D8.1
N$38
  Bottom 0.61: K1.2 Q5.3 19.52,6.5 18.41,5.4 15.88,5.4 15.24,4.76 15.24,2.54 15.87,1.91 D6.1
N$39
  Bottom 0.305: Q5.1 16.9,9.63 R35.1 R34.2
N$40
  Bottom 0.305: Q6.1 16.9,21.06 R39.1 15.03,20.52 R38.2
N$41
  Bottom 0.61: K3.2 Q7.3 19.52,30.31 17.78,28.57 16.19,28.57 15.56,27.94 15.56,25.4 16.19,24.77 D10.1
N$42
  Bottom 0.305: Q7.1 16.9,32.49 R43.1 13.54,32.49 R42.2
N$47
  Bottom 0.305: R33.1 6.03,40.01 X6.1
N$48
  Bottom 0.305: D7.3 2.01,38.15 R33.2 2.01,40.74 2.54,41.27 10.48,41.27 11.43,40.32 OK3.1
N$49
  Bottom 0.305: D7.1 6.2,35.09 X6.2 8.26,37.15 OK3.2
N$52
  Bottom 0.305: R37.1 13.02,48.9 X8.1
N$53  (via drill 0.6)
  Top 0.305: OK4.1 30.16,40.64 29.84,40.96 26.04,40.96 24.13,42.86 14.92,42.86 14.29,43.5 v14.29,48.26
  Bottom 0.305: D9.3 11.16,52.92 R37.2 13.76,52.92 14.29,52.39 v14.29,48.26
N$54
  Top 0.305: X8.2 8.57,43.18 9.53,42.23 23.81,42.23 25.72,40.32 27.3,40.32 27.62,40.01 OK4.2
  Bottom 0.305: D9.1 8.11,48.73 X8.2
N$56
  Bottom 0.305: R41.1 22.23,48.9 X10.1
N$57
  Bottom 0.305: R41.2 20.36,52.92 D11.3
  Bottom 0.406: OK5.1 28.89,50.64 28.1,49.85 25.4,49.85 24.61,50.64 24.61,52.23 23.91,52.92 R41.2
N$58
  Top 0.406: OK5.2 18.57,51.44 17.78,50.64 X10.2
  Bottom 0.406: D11.1 17.32,48.73 X10.2
N$80  (1 unrouted)
N$81  (1 unrouted)
N$82  (1 unrouted)
N$83  (1 unrouted)
N$84  (1 unrouted)
N$85  (1 unrouted)
OUT0  (via drill 0.5)
  Top 0.254: IC5.18 48.65,15.94 47.94,15.24
  Top 0.305: v11.43,19.37 12.38,19.37 13.02,20 19.05,20 20,19.05 24.61,19.05 26.83,16.83 26.83,15.56 27.15,15.24 47.94,15.24
  Bottom 0.305: v11.43,19.37 11.43,17.14 13.34,15.24 R34.1
OUT1  (via drill 0.5)
  Top 0.254: IC5.19 49.15,15.49 48.26,14.61
  Top 0.305: v18.1,19.05 18.73,18.41 24.29,18.41 26.19,16.51 26.19,14.92 26.51,14.61 48.26,14.61
  Bottom 0.305: R38.1 v18.1,19.05
OUT2  (via drill 0.5)
  Top 0.254: 49.65,15.04 IC5.20
  Top 0.305: v12.38,18.1 12.7,17.78 23.97,17.78 25.56,16.19 25.56,14.61 26.19,13.97 48.58,13.97 49.65,15.04
  Bottom 0.305: v12.38,18.1 12.38,18.41 12.7,18.73 12.7,22.54 13.34,23.18 R42.1
RS12V
  Bottom 0.61: 77.15,24.77 75.88,23.5 75.88,14.29 75.25,13.65 D1.A
RXD1  (1 unrouted)
  Top 0.254: IC5.31 58.99,24.38 59.69,25.08 59.69,37.94 59.69,38.26 59.69,39.37 59.37,39.69 57.94,39.69 57.62,40.02
SCL2
  Top 0.254: IC5.21 50.15,18.43 50.48,18.1
  Top 0.305: 50.48,18.1 52.07,18.1 53.02,17.14 53.02,16.88 JP2.2
  Bottom 0.305: R21.1 52.28,16.14 JP2.2
SDA2
  Top 0.254: IC5.22 50.65,18.89 50.8,18.73
  Top 0.305: 50.8,18.73 52.39,18.73 53.02,18.1 53.7,18.1 JP2.3
  Bottom 0.305: R22.1 53.76,15.61 JP2.3
SPI1_MISO  (via drill 0.5)
  Top 0.254: IC5.16 47.65,17.32 v47.15,16.83
  Top 0.305: v41.27,16.19 40.32,17.14 40.26,17.14 IC4.2
  Bottom 0.305: v41.27,16.19 | v41.27,16.19 41.75,15.72 46.04,15.72 v47.15,16.83
SPI1_MOSI
  Top 0.254: IC5.17 48.15,16.39 47.6,15.85
  Top 0.305: IC4.5 47.6,15.85
SPI1_NSS
  Top 0.254: IC5.14 46.65,18.7 46.35,18.41
  Top 0.305: 46.35,18.41 42.07,18.41 41.43,17.78 39.64,17.78 IC4.1 39.6,17.78 R20.1
SPI1_SCK
  Top 0.254: IC5.15 47.15,18.25 46.2,17.3
  Top 0.305: IC4.6 45.71,16.5 45.72,16.51 45.88,16.51 46.2,16.83 46.2,17.3
TIM2_CH1_ETR
  Top 0.254: IC5.10 42.87,22.38 TP5.PP
TIM2_CH2
  Top 0.254: IC5.11 43.31,21.88 42.86,21.43 TP6.PP
TXD1  (via drill 0.5)  (1 unrouted)
  Top 0.254: IC5.30 59.28,23.88 60.33,24.92 60.33,38.1 60.64,38.42 v60.64,38.89
  Bottom 0.305: v50.64,39.69 51.44,40.48 53.98,40.48 55.56,38.89 59.85,38.89 60.33,38.89 v60.64,38.89
UART2_RXD  (via drill 0.5)
  Top 0.254: IC5.13 46.15,19.32 45.88,19.05
  Top 0.305: v40.48,18.73 41.43,18.73 41.75,19.05 45.88,19.05
  Bottom 0.305: JP3.2 30.16,19.37 30.48,19.68 39.53,19.68 v40.48,18.73
UART2_TXD  (via drill 0.5)
  Top 0.254: IC5.12 43.76,21.38 42.7,20.32
  Top 0.305: v40.48,20.64 40.64,20.64 40.96,20.64 41.27,20.32 42.7,20.32
  Bottom 0.305: v40.48,20.64 40.16,20.32 30.16,20.32 29.53,19.68 29.53,18.1 28.26,16.83 JP3.1
USBDM
  Top 0.254: IC5.32 56.15,24.88 TP1.PP
USBDP
  Top 0.254: IC5.33 54.91,25.38 56.83,27.3
  Top 0.305: 56.83,27.3 56.83,27.62 TP2.PP
VBAT  (via drill 0.5)
  Top 0.254: v43.81,27.94 43.81,26.99 43.92,26.88 IC5.1
  Top 0.305: D5.2 29.69,23.5 30.16,23.97 JP5.1
  Bottom 0.305: v43.81,27.94 41.91,26.04 38.1,26.04 37.31,25.24 36.99,24.92 | 36.99,24.92 | 36.99,24.92 36.04,23.97 JP5.1
VPOW  (via drill 0.5)
  Top 0.813: v66.04,10.48 59.05,10.48 56.2,7.62 53.66,7.62 53.02,8.26 IC1.6
  Bottom 0.813: D2.C 39.5,5.93 C3.+ 42.67,7.94 R4.1 | R4.1 R5.1 | v66.04,10.48 D1.C | R4.1 43.82,6.67 44.77,5.71 47.94,5.71 R3.1
  pour Top (isolate 0.406): 57.78,-2.54 57.78,12.38 27.94,12.38 27.94,-2.54
XTAL1
  Top 0.254: 40.52,24.88 IC5.5
  Top 0.305: 40.52,24.88 40.01,25.4 Q4.1 39.71,27.52 C20.1
XTAL2
  Top 0.254: IC5.6 40.89,24.38 40.01,23.5
  Top 0.305: C21.1 39.66,22.64 Q4.2 40.01,23.5

### Text on the board
tStop: CANCOD v1.0
bStop: tuxotronic.org | Rev: